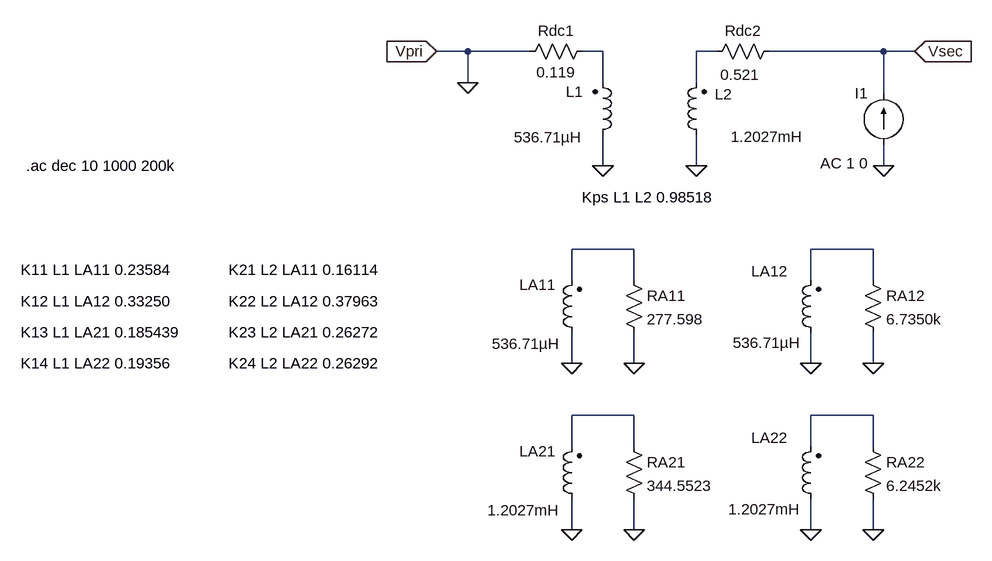
[diagram p0: schematic Mutual Impedance Transformer ZsecLeak.asc]
Mutual Impedance Transformer ZsecLeak.asc, the LTspice schematic file:
Version 4
SHEET 1 880 836
WIRE -112 80 -160 80
WIRE -16 80 -112 80
WIRE 96 80 64 80
WIRE 272 80 240 80
WIRE 528 80 352 80
WIRE 576 80 528 80
WIRE -112 128 -112 80
WIRE 96 128 96 80
WIRE 240 128 240 80
WIRE 528 144 528 80
WIRE 96 256 96 208
WIRE 240 256 240 208
WIRE 528 256 528 224
WIRE 144 384 48 384
WIRE 512 384 416 384
WIRE 48 432 48 384
WIRE 144 432 144 384
WIRE 416 432 416 384
WIRE 512 432 512 384
WIRE 48 560 48 512
WIRE 144 560 144 512
WIRE 416 560 416 512
WIRE 512 560 512 512
WIRE 144 640 48 640
WIRE 512 640 416 640
WIRE 48 688 48 640
WIRE 144 688 144 640
WIRE 416 688 416 640
WIRE 512 688 512 640
WIRE 48 816 48 768
WIRE 144 816 144 768
WIRE 416 816 416 768
WIRE 512 816 512 768
FLAG 96 256 0
FLAG 240 256 0
FLAG -160 80 Vpri
IOPIN -160 80 In
FLAG 576 80 Vsec
IOPIN 576 80 In
FLAG 48 560 0
FLAG 416 560 0
FLAG 144 560 0
FLAG 512 560 0
FLAG 48 816 0
FLAG 416 816 0
FLAG 144 816 0
FLAG 512 816 0
FLAG 528 256 0
FLAG -112 128 0
SYMBOL res 80 64 R90
WINDOW 0 0 56 VBottom 2
WINDOW 3 32 56 VTop 2
SYMATTR InstName Rdc1
SYMATTR Value 0.119
SYMBOL res 368 64 R90
WINDOW 0 0 56 VBottom 2
WINDOW 3 36 61 VTop 2
SYMATTR InstName Rdc2
SYMATTR Value 0.521
SYMBOL ind2 80 224 M180
WINDOW 0 -41 82 Left 2
WINDOW 3 -121 12 Left 2
SYMATTR InstName L1
SYMATTR Value 536.71µH
SYMATTR Type ind
SYMATTR SpiceLine Rser=0
SYMBOL ind2 256 224 R180
WINDOW 0 -39 78 Left 2
WINDOW 3 -149 13 Left 2
SYMATTR InstName L2
SYMATTR Value 1.2027mH
SYMATTR Type ind
SYMATTR SpiceLine Rser=0
SYMBOL ind2 64 528 R180
WINDOW 0 40 89 Left 2
WINDOW 3 34 -2 Left 2
SYMATTR InstName LA11
SYMATTR Value 536.71µH
SYMATTR Type ind
SYMATTR SpiceLine Rser=0
SYMBOL ind2 432 528 R180
WINDOW 0 51 110 Left 2
WINDOW 3 31 0 Left 2
SYMATTR InstName LA12
SYMATTR Value 536.71µH
SYMATTR Type ind
SYMATTR SpiceLine Rser=0
SYMBOL res 128 416 R0
SYMATTR InstName RA11
SYMATTR Value 277.598
SYMBOL res 496 416 R0
SYMATTR InstName RA12
SYMATTR Value 6.7350k
SYMBOL ind2 64 784 R180
WINDOW 0 40 89 Left 2
WINDOW 3 34 -2 Left 2
SYMATTR InstName LA21
SYMATTR Value 1.2027mH
SYMATTR Type ind
SYMATTR SpiceLine Rser=0
SYMBOL ind2 432 784 R180
WINDOW 0 51 110 Left 2
WINDOW 3 31 0 Left 2
SYMATTR InstName LA22
SYMATTR Value 1.2027mH
SYMATTR Type ind
SYMATTR SpiceLine Rser=0
SYMBOL res 128 672 R0
SYMATTR InstName RA21
SYMATTR Value 344.5523
SYMBOL res 496 672 R0
SYMATTR InstName RA22
SYMATTR Value 6.2452k
SYMBOL current 528 224 R180
WINDOW 0 24 80 Left 2
WINDOW 3 24 0 Invisible 2
WINDOW 123 24 -28 Left 2
WINDOW 39 0 0 Left 0
SYMATTR InstName I1
SYMATTR Value 0
SYMATTR Value2 AC 1 0
TEXT 64 304 Left 2 !Kps L1 L2 0.98518
TEXT -800 416 Left 2 !K11 L1 LA11 0.23584
TEXT -800 464 Left 2 !K12 L1 LA12 0.33250
TEXT -800 512 Left 2 !K13 L1 LA21 0.185439
TEXT -800 560 Left 2 !K14 L1 LA22 0.19356
TEXT -480 416 Left 2 !K21 L2 LA11 0.16114
TEXT -480 464 Left 2 !K22 L2 LA12 0.37963
TEXT -480 512 Left 2 !K23 L2 LA21 0.26272
TEXT -480 560 Left 2 !K24 L2 LA22 0.26292
TEXT -792 256 Left 2 !.ac dec 10 1000 200k

The netlist it stands for:
* Mutual Impedance Transformer ZsecLeak.asc
Rdc1 N001 0 0.119
Rdc2 Vsec N002 0.521
L1 0 N001 536.71µH Rser=0
L2 0 N002 1.2027mH Rser=0
LA11 0 N003 536.71µH Rser=0
LA12 0 N004 536.71µH Rser=0
RA11 N003 0 277.598
RA12 N004 0 6.7350k
LA21 0 N005 1.2027mH Rser=0
LA22 0 N006 1.2027mH Rser=0
RA21 N005 0 344.5523
RA22 N006 0 6.2452k
I1 0 Vsec 0 AC 1 0
Kps L1 L2 0.98518
K11 L1 LA11 0.23584
K12 L1 LA12 0.33250
K13 L1 LA21 0.185439
K14 L1 LA22 0.19356
K21 L2 LA11 0.16114
K22 L2 LA12 0.37963
K23 L2 LA21 0.26272
K24 L2 LA22 0.26292
.ac dec 10 1000 200k
.backanno
.end